# EAGLE schematic converter (EAGLE 9.6.2)
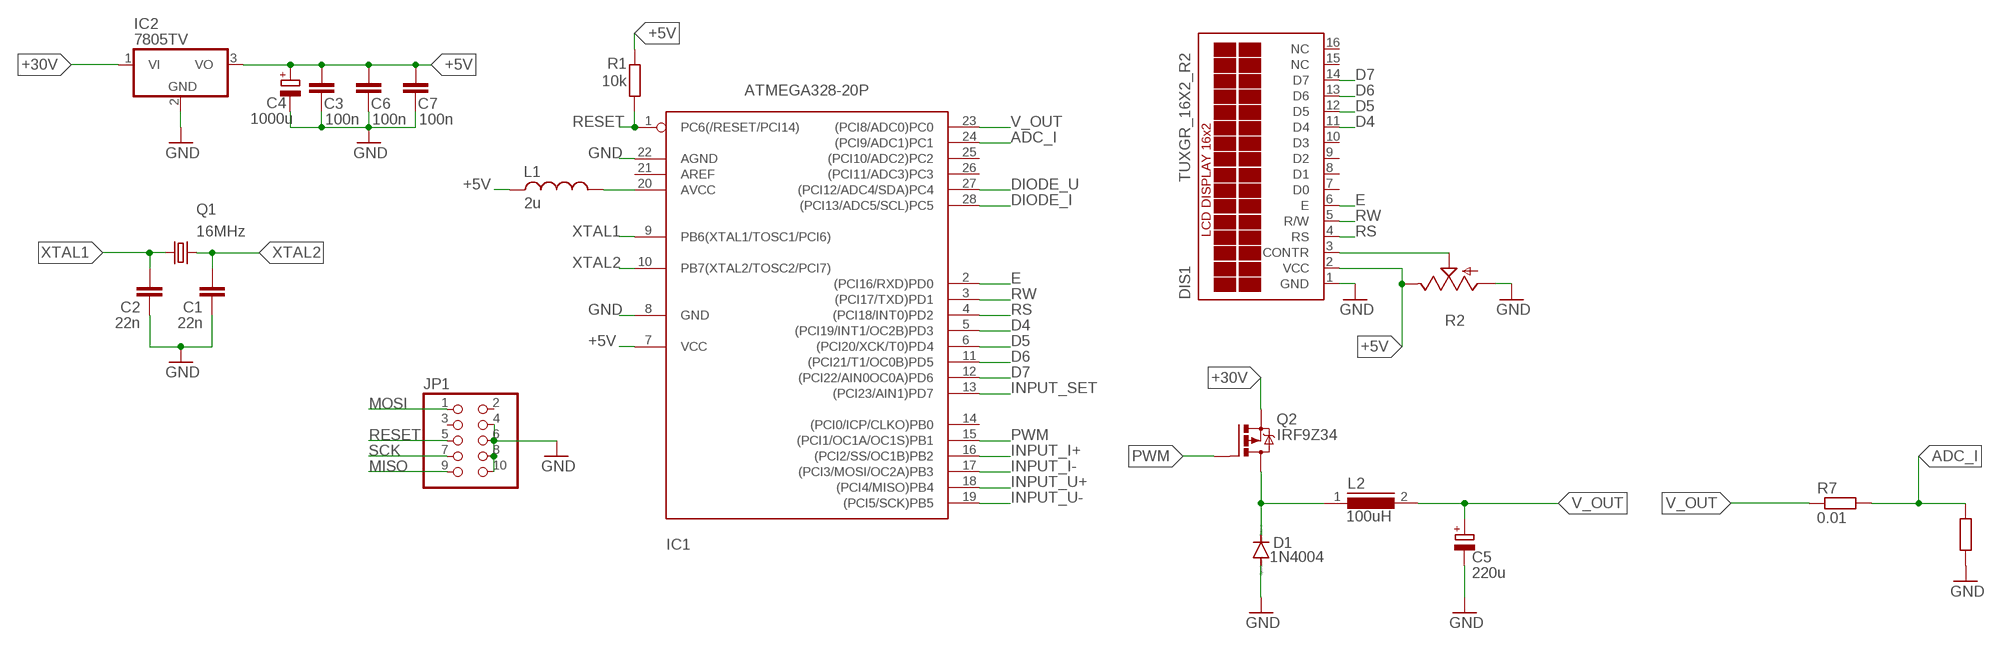
[diagram p0: schematic, sheet 1]

## Parts
C1  22n  C2,5-3  [C2.5-3]
C2  22n  C2,5-3  [C2.5-3]
C3  100n  C2,5-3  [C2.5-3]
C4  1000u  CPOL-EUE2.5-7  [E2,5-7]
C5  220u  CPOL-EUE2.5-7  [E2,5-7]
C6  100n  C2,5-3  [C2.5-3]
C7  100n  C2,5-3  [C2.5-3]
D1  1N4004  [DO41-10]
DIS1  TUXGR_16X2_R2  [TUXGR_16X2_R2]
IC1  ATMEGA328-20P  [DIL28-3]
IC2  7805TV  [TO220V]
JP1  PINHD-2X5  [2X05]
L1  2u  L-US0204/7  [0204/7]
L2  100uH  ED26  [ED26]
Q1  16MHz  CRYSTALHC49S  [HC49/S]
Q2  IRF9Z34  IRF4905  [TO220BH]
R1  10k  R-EU_0204/7  [0204/7]
R2  TRIM_US-LI15  [LI15]
R7  0.01  R-EU_0207/10  [0207/10]

## Nets
+5V: C3.2 C4.+ C6.2 C7.2 DIS1.2(VCC) IC1.7(VCC) IC2.3(VO) L1.1 R1.2 R2.E
+30V: IC2.1(VI) Q2.S
ADC_I: IC1.24((PCI9/ADC1)PC1) R7.2
D4: DIS1.11(D4) IC1.5((PCI19/INT1/OC2B)PD3)
D5: DIS1.12(D5) IC1.6((PCI20/XCK/T0)PD4)
D6: DIS1.13(D6) IC1.11((PCI21/T1/OC0B)PD5)
D7: DIS1.14(D7) IC1.12((PCI22/AIN0OC0A)PD6)
DIODE_I: IC1.28((PCI13/ADC5/SCL)PC5)
DIODE_U: IC1.27((PCI12/ADC4/SDA)PC4)
E: DIS1.6(E) IC1.2((PCI16/RXD)PD0)
GND: C1.1 C2.1 C3.1 C4.- C5.- C6.1 C7.1 D1.A DIS1.1(GND) IC1.8(GND) IC1.22(AGND) IC2.2(GND) JP1.4 JP1.6 JP1.8 JP1.10 R2.A
INPUT_I+: IC1.16((PCI2/SS/OC1B)PB2)
INPUT_I-: IC1.17((PCI3/MOSI/OC2A)PB3)
INPUT_SET: IC1.13((PCI23/AIN1)PD7)
INPUT_U+: IC1.18((PCI4/MISO)PB4)
INPUT_U-: IC1.19((PCI5/SCK)PB5)
MISO: JP1.9
MOSI: JP1.1
N$1: IC1.20(AVCC) L1.2
N$2: D1.C L2.1 Q2.D
N$3: DIS1.3(CONTR) R2.S
PWM: IC1.15((PCI1/OC1A/OC1S)PB1) Q2.G
RESET: IC1.1(PC6(/RESET/PCI14)) JP1.5 R1.1
RS: DIS1.4(RS) IC1.4((PCI18/INT0)PD2)
RW: DIS1.5(R/W) IC1.3((PCI17/TXD)PD1)
SCK: JP1.7
V_OUT: C5.+ IC1.23((PCI8/ADC0)PC0) L2.2 R7.1
XTAL1: C2.2 IC1.9(PB6(XTAL1/TOSC1/PCI6)) Q1.2
XTAL2: C1.2 IC1.10(PB7(XTAL2/TOSC2/PCI7)) Q1.1
Unconnected: DIS1.7(D0) DIS1.8(D1) DIS1.9(D2) DIS1.10(D3) DIS1.15(NC) DIS1.16(NC) IC1.14((PCI0/ICP/CLKO)PB0) IC1.21(AREF) IC1.25((PCI10/ADC2)PC2) IC1.26((PCI11/ADC3)PC3) JP1.2 JP1.3

## Library data of the parts
C1-C3 C6 C7 = capacitor-wima:C: CAPACITOR naming: grid - package width
C4 C5 = resistor:CPOL-EU: POLARIZED CAPACITOR, European symbol
D1 = diode:1N4004: DIODE general purpose rectifier, 1 A
DIS1 = display-lcd:TUXGR_16X2_R2: Tuxgraphics LCD display 16x2 characters reflective, without background light Source: tuxgr_12x2_r2.pdf; OC_FARNELL: unknown; OC_NEWARK: unknown
IC1 = atmega328:ATMEGA328*P: MICROCONTROLLER 32 kBytes FLASH 2 kBytes SRAM 1 kBytes EEPROM USART 8-channel 10 bit ADC
IC2 = linear:78*: Positive VOLTAGE REGULATOR Source: http://cache.national.com/ds/LM/LM78L05.pdf http://www.fairchildsemi.com/ds/LM/LM7805.pdf
JP1 = pinhead:PINHD-2X5: PIN HEADER
L1 = rcl:L-US: INDUCTOR, American symbol; SPICEPREFIX: L
L2 = inductors:ED26: INDUCTOR; SPICEPREFIX: L
Q1 = crystal:CRYSTAL: CRYSTAL; OC_FARNELL: 1667008; OC_NEWARK: unknown
Q2 = transistor-power:IRF4905: P-Channel HEXFET® Power MOSFET RDS(on)= 0.02 Ohm, ID = -74A Source: http://www.irf.com/product-info/datasheets/data/irf4905pbf.pdf
R1 = resistor:R-EU_: RESISTOR, European symbol
R2 = pot:TRIM_US-: POTENTIOMETER
R7 = rcl:R-EU_: RESISTOR, European symbol; SPICEPREFIX: R